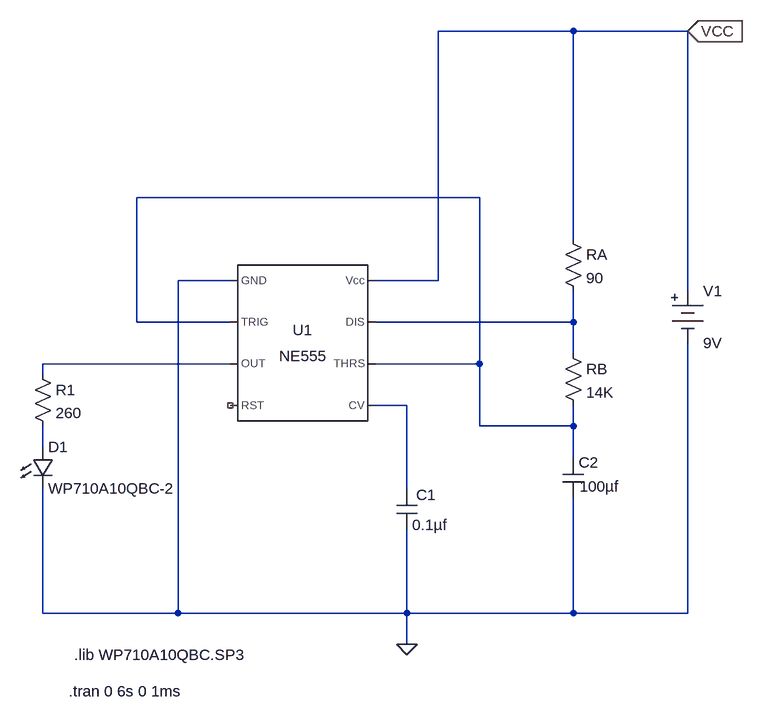
[diagram p0: schematic 555 timer Sch..asc]
555 timer Sch..asc, the LTspice schematic file:
Version 4
SHEET 1 1280 840
WIRE 720 -192 512 -192
WIRE 896 -192 720 -192
WIRE 576 64 48 64
WIRE 720 128 720 -192
WIRE 192 192 112 192
WIRE 512 192 512 -192
WIRE 512 192 416 192
WIRE 896 208 896 -192
WIRE 48 256 48 64
WIRE 192 256 48 256
WIRE 720 256 720 208
WIRE 720 256 416 256
WIRE 720 304 720 256
WIRE 192 320 -96 320
WIRE 576 320 576 64
WIRE 576 320 416 320
WIRE -96 336 -96 320
WIRE 464 384 416 384
WIRE 576 416 576 320
WIRE 720 416 720 384
WIRE 720 416 576 416
WIRE -96 448 -96 416
WIRE 720 464 720 416
WIRE 464 512 464 384
WIRE -96 704 -96 512
WIRE 112 704 112 192
WIRE 112 704 -96 704
WIRE 464 704 464 576
WIRE 464 704 112 704
WIRE 720 704 720 528
WIRE 720 704 464 704
WIRE 896 704 896 288
WIRE 896 704 720 704
WIRE 464 752 464 704
FLAG 464 752 0
FLAG 896 -192 VCC
IOPIN 896 -192 In
SYMBOL Misc/NE555 304 288 R0
SYMATTR InstName U1
SYMBOL res -112 320 R0
SYMATTR InstName R1
SYMATTR Value 260
SYMBOL res 704 288 R0
SYMATTR InstName RB
SYMATTR Value 14K
SYMBOL res 704 112 R0
SYMATTR InstName RA
SYMATTR Value 90
SYMBOL cap 448 512 R0
WINDOW 0 30 10 Left 2
SYMATTR InstName C1
SYMATTR Value 0.1µf
SYMBOL cap 704 464 R0
WINDOW 3 26 45 Left 2
SYMATTR InstName C2
SYMATTR Value 100µf
SYMBOL LED -112 448 R0
SYMATTR InstName D1
SYMATTR Value WP710A10QBC-2
SYMBOL Misc/battery 896 192 R0
SYMATTR InstName V1
SYMATTR Value 9V
TEXT -48 768 Left 2 !.lib WP710A10QBC.SP3
TEXT -56 824 Left 2 !.tran 0 6s 0 1ms

The netlist it stands for:
* 555 timer Sch..asc
XU1 0 N001 N003 NC_01 N004 N001 N002 VCC NE555  ; pins GND TRIG OUT RST CV THRS DIS Vcc
R1 N003 N005 260
RB N002 N001 14K
RA VCC N002 90
C1 N004 0 0.1µf
C2 N001 0 100µf
D1 N005 0 WP710A10QBC-2
V1 VCC 0 9V
.model D D
.lib standard.dio
.lib WP710A10QBC.SP3
.tran 0 6s 0 1ms
.lib NE555.sub
.backanno
.end